# Altium schematic sheet Schematic-DeepAmbiente.schdoc
size 385 x 256 mm
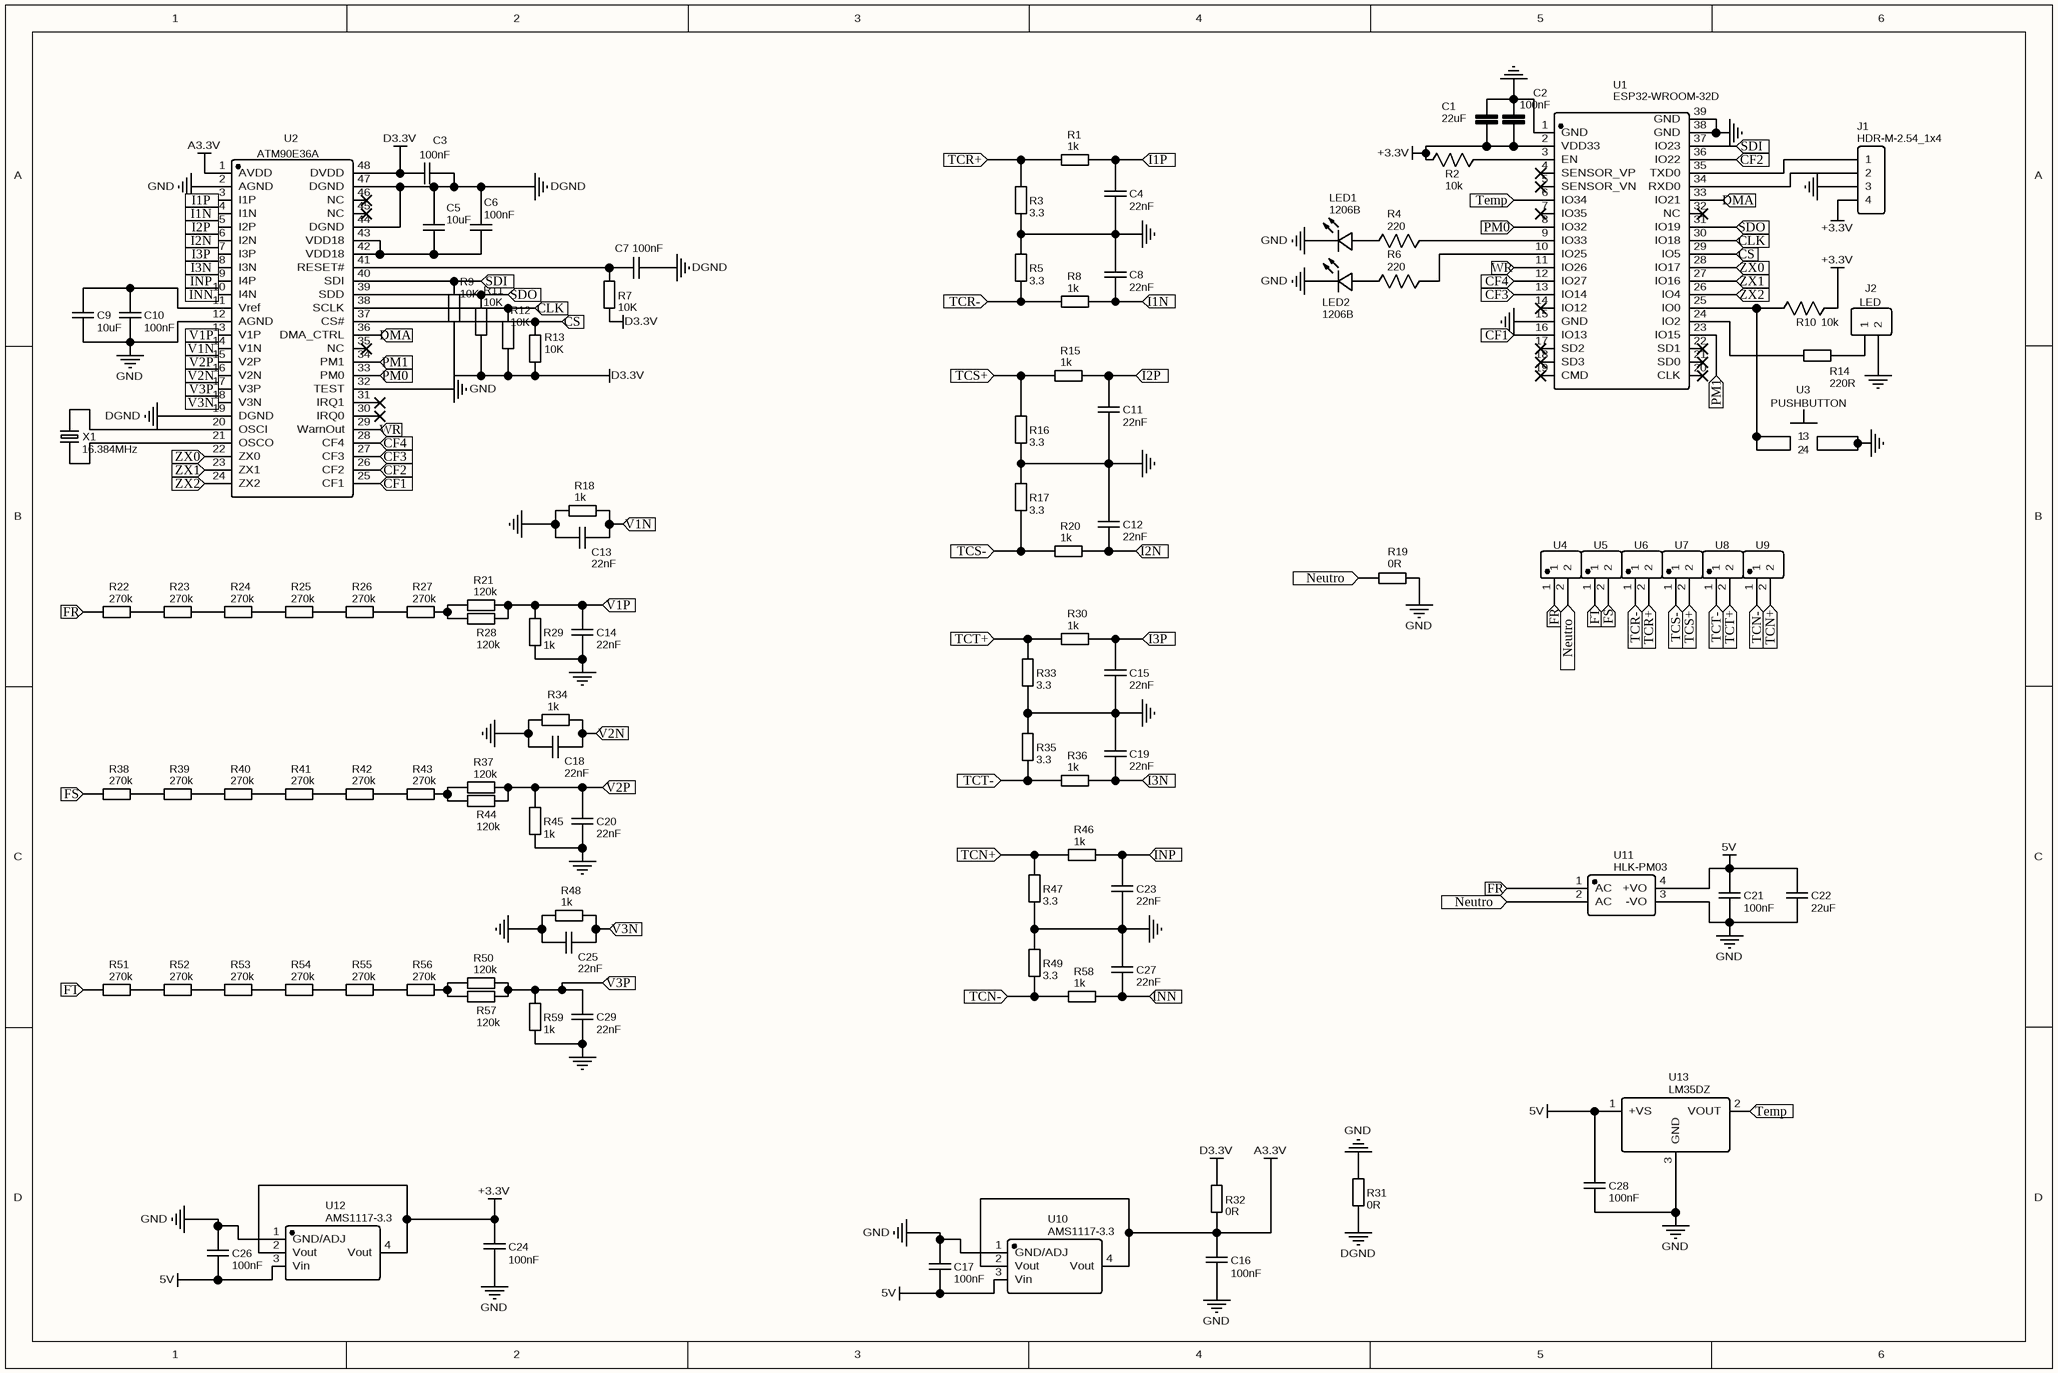
[diagram p0: Schematic-DeepAmbiente.schdoc]

## Parts
C1  22uF  [C0805]
C2  100nF  [C1206]
C3  100nF  [R1206]
C4  22nF  [C0805]
C5  10uF  [C0805]
C6  100nF  [R1206]
C7  100nF  [R1206]
C8  22nF  [C0805]
C9  10uF  [C0805]
C10  100nF  [R1206]
C11  22nF  [C0805]
C12  22nF  [C0805]
C13  22nF  [C0805]
C14  22nF  [C0805]
C15  22nF  [C0805]
C16  100nF  [C0805]
C17  100nF  [C0805]
C18  22nF  [C0805]
C19  22nF  [C0805]
C20  22nF  [C0805]
C21  100nF  [R1206]
C22  22uF  [C0805]
C23  22nF  [C0805]
C24  100nF  [C0805]
C25  22nF  [C0805]
C26  100nF  [C0805]
C27  22nF  [C0805]
C28  100nF  [R1206]
C29  22nF  [C0805]
J1  HDR-M-2.54_1x4  [HDR-M-2.54_1X4]
J2  LED  [HDR-M-2.54_1X2]
LED1  1206B  [LED1206-R-RD]
LED2  1206B  [LED1206-R-RD]
R1  1k  [R1206]
R2  10k  [R1206]
R3  3.3  [R0805]
R4  220  [1206]
R5  3.3  [R0805]
R6  220  [1206]
R7  10K  [R1206]
R8  1k  [R1206]
R9  10K  [R1206]
R10  10k  [R1206]
R11  10K  [R1206]
R12  10K  [R1206]
R13  10K  [R1206]
R14  220R  [R1206]
R15  1k  [R1206]
R16  3.3  [R0805]
R17  3.3  [R0805]
R18  1k  [R1206]
R19  0R  [R1206]
R20  1k  [R1206]
R21  120k  [R0805]
R22  270k  [R0805]
R23  270k  [R0805]
R24  270k  [R0805]
R25  270k  [R0805]
R26  270k  [R0805]
R27  270k  [R0805]
R28  120k  [R0805]
R29  1k  [R1206]
R30  1k  [R1206]
R31  0R  [R1206]
R32  0R  [R1206]
R33  3.3  [R0805]
R34  1k  [R1206]
R35  3.3  [R0805]
R36  1k  [R1206]
R37  120k  [R0805]
R38  270k  [R0805]
R39  270k  [R0805]
R40  270k  [R0805]
R41  270k  [R0805]
R42  270k  [R0805]
R43  270k  [R0805]
R44  120k  [R0805]
R45  1k  [R1206]
R46  1k  [R1206]
R47  3.3  [R0805]
R48  1k  [R1206]
R49  3.3  [R0805]
R50  120k  [R0805]
R51  270k  [R0805]
R52  270k  [R0805]
R53  270k  [R0805]
R54  270k  [R0805]
R55  270k  [R0805]
R56  270k  [R0805]
R57  120k  [R0805]
R58  1k  [R1206]
R59  1k  [R1206]
U1  ESP32-WROOM-32D  [WIFIM-SMD_39P-L25.5-W18.0-P1.27-BL]
U2  ATM90E36A  [TQFP-48_L7.0-W7.0-P0.50-LS9.0-BL]
U3  PUSHBUTTON  [PUSH BUTTON 4 PIN DIP]
U4  KF301-5.0-2P  [CONN-TH_P5.00_KF301-5.0-2P]  (value not drawn)
U5  KF301-5.0-2P  [CONN-TH_P5.00_KF301-5.0-2P]  (value not drawn)
U6  KF301-5.0-2P  [CONN-TH_P5.00_KF301-5.0-2P]  (value not drawn)
U7  KF301-5.0-2P  [CONN-TH_P5.00_KF301-5.0-2P]  (value not drawn)
U8  KF301-5.0-2P  [CONN-TH_P5.00_KF301-5.0-2P]  (value not drawn)
U9  KF301-5.0-2P  [CONN-TH_P5.00_KF301-5.0-2P]  (value not drawn)
U10  AMS1117-3.3  [SOT-223-3_L6.5-W3.4-P2.30-LS7.0-BR]
U11  HLK-PM03  [PWRM-TH_HLK-PM03]
U12  AMS1117-3.3  [SOT-223-3_L6.5-W3.4-P2.30-LS7.0-BR]
U13  LM35DZ  [TO-92-3_L4.9-W3.7-P1.27-L]
X1  16.384MHz  [HC-49US_L11.5-W4.5-P4.88]

## Ports
CF1 (in), CF2 (in), CF3 (in), CF4 (in), CLK (in), CS (in), DMA (in), FR (in), FS (in), FT (in), I1N (in), I1P (in), I2N (in), I2P (in), I3N (in), I3P (in), INN (in), INP (in), Neutro (in), PM0 (in), PM1 (in), SDI (in), SDO (in), TCN+ (in), TCN- (in), TCR+ (in), TCR- (in), TCS+ (in), TCS- (in), TCT+ (in), TCT- (in), Temp (in), V1N (in), V1P (in), V2N (in), V2P (in), V3N (in), V3P (in), WR (in), ZX0 (in), ZX1 (in), ZX2 (in)

## Nets
5V: C17.2 C21.2 C22.2 C26.2 C28.2 U10.3(Vin) U11.4(+VO) U12.3(Vin) U13.1(+VS)
+3.3V: C1.2 C2.2 C24.1 J1.4 R2.1 R10.2 U1.2(VDD33) U12.2(Vout) U12.4(Vout)
A3.3V: C16.1 R32.1 U2.1(AVDD) U10.2(Vout) U10.4(Vout)
D3.3V: C3.1 R7.1 R9.1 R11.1 R12.1 R13.1 R32.2 U2.48(DVDD)
DGND: C3.2 C5.2 C6.2 C7.1 R31.1 U2.19(DGND) U2.44(DGND) U2.47(DGND)
GND: C1.1 C2.1 C4.1 C8.2 C9.1 C10.1 C11.1 C12.2 C13.2 C14.1 C15.1 C16.2 C17.1 C18.2 C19.2 C20.1 C21.1 C22.1 C23.1 C24.2 C25.2 C26.1 C27.2 C28.1 C29.1 J1.3 J2.2 LED1.2 LED2.2 R3.1 R5.2 R16.1 R17.2 R18.2 R19.2 R29.2 R31.2 R33.1 R34.2 R35.2 R45.2 R47.1 R48.2 R49.2 R59.2 U1.1(GND) U1.15(GND) U1.38(GND) U1.39(GND) U2.2(AGND) U2.12(AGND) U2.32(TEST) U3.3 U3.4 U10.1(GND/ADJ) U11.3(-VO) U12.1(GND/ADJ) U13.3(GND)
CF1: U1.16(IO13) U2.25(CF1) ; port CF1
CF2: U1.36(IO22) U2.26(CF2) ; port CF2
CF3: U1.13(IO14) U2.27(CF3) ; port CF3
CF4: U1.12(IO27) U2.28(CF4) ; port CF4
CLK: R12.2 U1.30(IO18) U2.38(SCLK) ; port CLK
CS: R13.2 U1.29(IO5) U2.37(CS#) ; port CS
DMA: U1.33(IO21) U2.36(DMA_CTRL) ; port DMA
FR: R22.2 U4.1 U11.1(AC) ; port FR
FS: R38.2 U5.2 ; port FS
FT: R51.2 U5.1 ; port FT
I1N: C8.1 R8.1 U2.4(I1N) ; port I1N
I1P: C4.2 R1.1 U2.3(I1P) ; port I1P
I2N: C12.1 R20.1 U2.6(I2N) ; port I2N
I2P: C11.2 R15.1 U2.5(I2P) ; port I2P
I3N: C19.1 R36.1 U2.8(I3N) ; port I3N
I3P: C15.2 R30.1 U2.7(I3P) ; port I3P
INN: C27.1 R58.1 U2.10(I4N) ; port INN
INP: C23.2 R46.1 U2.9(I4P) ; port INP
Neutro: R19.1 U4.2 U11.2(AC) ; port Neutro
PM0: U1.8(IO32) U2.33(PM0) ; port PM0
PM1: U1.23(IO15) U2.34(PM1) ; port PM1
SDI: R9.2 U1.37(IO23) U2.40(SDI) ; port SDI
SDO: R11.2 U1.31(IO19) U2.39(SDD) ; port SDO
TCN+: R46.2 R47.2 U9.2 ; port TCN+
TCN-: R49.1 R58.2 U9.1 ; port TCN-
TCR+: R1.2 R3.2 U6.2 ; port TCR+
TCR-: R5.1 R8.2 U6.1 ; port TCR-
TCS+: R15.2 R16.2 U7.2 ; port TCS+
TCS-: R17.1 R20.2 U7.1 ; port TCS-
TCT+: R30.2 R33.2 U8.2 ; port TCT+
TCT-: R35.1 R36.2 U8.1 ; port TCT-
Temp: U1.6(IO34) U13.2(VOUT) ; port Temp
V1N: C13.1 R18.1 U2.14(V1N) ; port V1N
V1P: C14.2 R21.1 R28.1 R29.1 U2.13(V1P) ; port V1P
V2N: C18.1 R34.1 U2.16(V2N) ; port V2N
V2P: C20.2 R37.1 R44.1 R45.1 U2.15(V2P) ; port V2P
V3N: C25.1 R48.1 U2.18(V3N) ; port V3N
V3P: C29.2 R50.1 R57.1 R59.1 U2.17(V3P) ; port V3P
WR: U1.11(IO26) U2.29(WarnOut) ; port WR
ZX0: U1.28(IO17) U2.22(ZX0) ; port ZX0
ZX1: U1.27(IO16) U2.23(ZX1) ; port ZX1
ZX2: U1.26(IO4) U2.24(ZX2) ; port ZX2
NetC5_1: C5.1 C6.1 U2.42(VDD18) U2.43(VDD18)
NetC7_2: C7.2 R7.2 U2.41(RESET#)
NetC9_2: C9.2 C10.2 U2.11(Vref)
NetJ1_1: J1.1 U1.35(TXD0)
NetJ1_2: J1.2 U1.34(RXD0)
NetJ2_1: J2.1 R14.1
NetLED1_1: LED1.1 R4.1
NetLED2_1: LED2.1 R6.1
NetR2_2: R2.2 U1.3(EN)
NetR4_2: R4.2 U1.9(IO33)
NetR6_2: R6.2 U1.10(IO25)
NetR10_1: R10.1 U1.25(IO0) U3.1 U3.2
NetR14_2: R14.2 U1.24(IO2)
NetR21_2: R21.2 R27.1 R28.2
NetR22_1: R22.1 R23.2
NetR23_1: R23.1 R24.2
NetR24_1: R24.1 R25.2
NetR25_1: R25.1 R26.2
NetR26_1: R26.1 R27.2
NetR37_2: R37.2 R43.1 R44.2
NetR38_1: R38.1 R39.2
NetR39_1: R39.1 R40.2
NetR40_1: R40.1 R41.2
NetR41_1: R41.1 R42.2
NetR42_1: R42.1 R43.2
NetR50_2: R50.2 R56.1 R57.2
NetR51_1: R51.1 R52.2
NetR52_1: R52.1 R53.2
NetR53_1: R53.1 R54.2
NetR54_1: R54.1 R55.2
NetR55_1: R55.1 R56.2
NetU2_20: U2.20(OSCI) X1.2
NetU2_21: U2.21(OSCO) X1.1

Not connected (* = marked no-connect by the designer): U1 4(SENSOR_VP)* 5(SENSOR_VN)* 7(IO35)* 14(IO12)* 17(SD2)* 18(SD3)* 19(CMD)* 20(CLK)* 21(SD0)* 22(SD1)* 32(NC)*; U2 30(IRQ0)* 31(IRQ1)* 35(NC)* 45(NC)* 46(NC)*

## Library data of the parts
C1 = 22uF: description: Non-Polarized capacitor in various packages; Contributor: DangerousPrototype; spicePre: C; spiceSymbolName: CAPACITOR_NPOL-1206
C2 = 100nF: description: Non-Polarized capacitor in various packages; Contributor: DangerousPrototype; spicePre: C; spiceSymbolName: CAPACITOR_NPOL-1206
C3 C6 C7 C10 C16 C17 C21 C24 C26 C28 = 100nF: Contributor: Adisak Choochan; spicePre: C; spiceSymbolName: C_1206
C4 C8 C11-C15 C18-C20 C23 C25 C27 C29 = 22nF: Contributor: Adisak Choochan; spicePre: C; spiceSymbolName: C_1206
C5 C9 = 10uF: Contributor: Adisak Choochan; spicePre: C; spiceSymbolName: C_1206
C22 = 22uF: Contributor: Adisak Choochan; spicePre: C; spiceSymbolName: C_1206
J1 = HDR-M-2.54_1x4: Contributor: LCEDA_Lib; BOM_Supplier Part: C124378; BOM_Supplier: LCSC; spicePre: J; spiceSymbolName: HDR-M-2.54_1x4
J2 = LED: Contributor: LCEDA_Lib; BOM_Supplier Part: C124375; BOM_Supplier: LCSC; spicePre: J; spiceSymbolName: HDR-M-2.54_1x2
LED1 LED2 = 1206B: BOM_Manufacturer: KENTO; SMT Type: Extend; BOM_Supplier: LCSC; BOM_Manufacturer Part: 1206B; image: //image.lceda.cn/szlcsc/C72691.jpg; BOM_Supplier Part: C72691; BOM_JLCPCB SMD: Yes; spicePre: L; spiceSymbolName: 1206B
R1 R8 R15 R18 R20 R29 R30 R34 R36 R45 R46 R48 R58 R59 = 1k: BOM_Manufacturer: Shenzhen Eyang Tech Development; BOM_Manufacturer Part: R1206RXX302XJ04LTC; nameAlias: Resistance (Ohms); Contributor: LCSC; BOM_Supplier: LCSC; BOM_Supplier Part: C267249; BOM_JLCPCB Part Class: Extended Part; spicePre: R; spiceSymbolName: R1206RXX302XJ04LTC
R2 R10 = 10k: nameAlias: Value(Ω); spicePre: R; spiceSymbolName: Res_1206(1/4W)_US
R3 R5 R16 R17 R33 R35 R47 R49 = 3.3: BOM_Manufacturer: Shenzhen Eyang Tech Development; BOM_Manufacturer Part: R1206RXX302XJ04LTC; nameAlias: Resistance (Ohms); Contributor: LCSC; BOM_Supplier: LCSC; BOM_Supplier Part: C267249; BOM_JLCPCB Part Class: Extended Part; spicePre: R; spiceSymbolName: R1206RXX302XJ04LTC
R4 R6 = 220: nameAlias: Value(Ω); spicePre: R; spiceSymbolName: Res_1206(1/4W)_US
R7 R9 R11-R13 = 10K: BOM_Manufacturer: Shenzhen Eyang Tech Development; BOM_Manufacturer Part: R1206RXX302XJ04LTC; nameAlias: Resistance (Ohms); Contributor: LCSC; BOM_Supplier: LCSC; BOM_Supplier Part: C267249; BOM_JLCPCB Part Class: Extended Part; spicePre: R; spiceSymbolName: R1206RXX302XJ04LTC
R14 = 220R: BOM_Manufacturer: Shenzhen Eyang Tech Development; BOM_Manufacturer Part: R1206RXX302XJ04LTC; nameAlias: Resistance (Ohms); Contributor: LCSC; BOM_Supplier: LCSC; BOM_Supplier Part: C267249; BOM_JLCPCB Part Class: Extended Part; spicePre: R; spiceSymbolName: R1206RXX302XJ04LTC
R19 R31 R32 = 0R: BOM_Manufacturer: Shenzhen Eyang Tech Development; BOM_Manufacturer Part: R1206RXX302XJ04LTC; nameAlias: Resistance (Ohms); Contributor: LCSC; BOM_Supplier: LCSC; BOM_Supplier Part: C267249; BOM_JLCPCB Part Class: Extended Part; spicePre: R; spiceSymbolName: R1206RXX302XJ04LTC
R21 R28 R37 R44 R50 R57 = 120k: BOM_Manufacturer: Shenzhen Eyang Tech Development; BOM_Manufacturer Part: R1206RXX302XJ04LTC; nameAlias: Resistance (Ohms); Contributor: LCSC; BOM_Supplier: LCSC; BOM_Supplier Part: C267249; BOM_JLCPCB Part Class: Extended Part; spicePre: R; spiceSymbolName: R1206RXX302XJ04LTC
R22-R27 R38-R43 R51-R56 = 270k: BOM_Manufacturer: Shenzhen Eyang Tech Development; BOM_Manufacturer Part: R1206RXX302XJ04LTC; nameAlias: Resistance (Ohms); Contributor: LCSC; BOM_Supplier: LCSC; BOM_Supplier Part: C267249; BOM_JLCPCB Part Class: Extended Part; spicePre: R; spiceSymbolName: R1206RXX302XJ04LTC
U1 = ESP32-WROOM-32D: BOM_Manufacturer: ESPRESSIF 乐鑫; Contributor: LCSC; BOM_Supplier: LCSC; BOM_Supplier Part: C473012; BOM_Manufacturer Part: ESP32-WROOM-32D; BOM_JLCPCB Part Class: Extended Part; spicePre: U; spiceSymbolName: ESP32-WROOM-32D
U2 = ATM90E36A: BOM_Manufacturer: Microchip Tech; BOM_Manufacturer Part: ATM90E36A-AU-R; Contributor: LCSC; BOM_Supplier: LCSC; BOM_Supplier Part: C481363; BOM_JLCPCB Part Class: Extended Part; spicePre: U; spiceSymbolName: ATM90E36A-AU-R
U3 = PUSHBUTTON: Contributor: elnino; BOM_Manufacturer Part: Pushbutton; BOM_Supplier: LAMINGTON; spicePre: U; spiceSymbolName: PUSHBUTTON 4 PIN DIP
U4-U9 = KF301-5.0-2P: BOM_Manufacturer: Cixi Kefa Elec; Contributor: LCSC; BOM_Supplier: LCSC; BOM_Supplier Part: C474881; BOM_Manufacturer Part: KF301-5.0-2P; BOM_JLCPCB Part Class: Extended Part; spicePre: U; spiceSymbolName: KF301-5.0-2P
U10 U12 = AMS1117-3.3: BOM_Manufacturer: AMS; sourceId: dwIGgezVh; timeStamp: 1476261164; BOM_Supplier: LCSC; BOM_Manufacturer Part: AMS1117-3.3; BOM_Supplier Part: C6186; BOM_JLCPCB Part Class: Basic Part; spicePre: U; spiceSymbolName: AMS1117-3.3
U11 = HLK-PM03: BOM_Manufacturer: HI-LINK; Contributor: LCSC; BOM_Supplier: LCSC; BOM_Supplier Part: C209904; BOM_Manufacturer Part: HLK-PM03; BOM_JLCPCB Part Class: Extended Part; spicePre: U; spiceSymbolName: HLK-PM03
U13 = LM35DZ: BOM_Manufacturer: TI; BOM_Supplier: LCSC; BOM_Manufacturer Part: LM35DZ; BOM_Supplier Part: C12165; BOM_JLCPCB Part Class: Extended Part; spicePre: U; spiceSymbolName: LM35DZ
X1 = 16.384MHz: BOM_Manufacturer: Suzhou Liming Elec; BOM_Manufacturer Part: 49S-16.384-20-20-20/A; nameAlias: Frequency; Contributor: LCSC; BOM_Supplier: LCSC; BOM_Supplier Part: C240932; BOM_JLCPCB Part Class: Extended Part; spicePre: X; spiceSymbolName: 49S-16.384-20-20-20/A